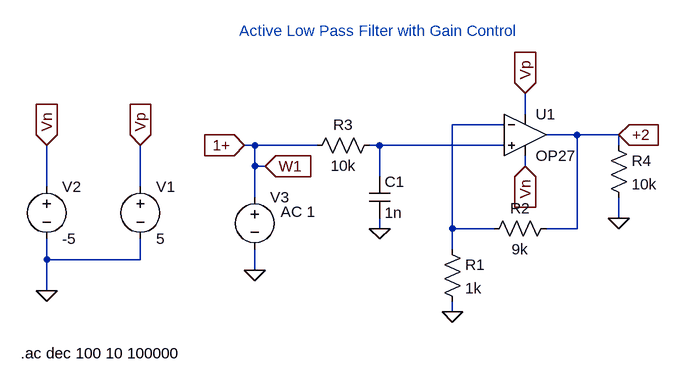
[diagram p0: schematic alpf_gain.asc]
alpf_gain.asc, the LTspice schematic file:
Version 4
SHEET 1 880 680
WIRE 208 -464 208 -496
WIRE 176 -448 96 -448
WIRE 288 -432 240 -432
WIRE 352 -432 288 -432
WIRE -208 -416 -224 -416
WIRE -112 -416 -208 -416
WIRE -16 -416 -32 -416
WIRE 176 -416 -16 -416
WIRE 352 -416 352 -432
WIRE -208 -384 -208 -416
WIRE -192 -384 -208 -384
WIRE 208 -384 208 -400
WIRE -16 -368 -16 -416
WIRE -528 -352 -528 -416
WIRE -384 -352 -384 -416
WIRE -208 -336 -208 -384
WIRE 352 -304 352 -336
WIRE -16 -288 -16 -304
WIRE 96 -288 96 -448
WIRE 160 -288 96 -288
WIRE 288 -288 288 -432
WIRE 288 -288 240 -288
WIRE 96 -256 96 -288
WIRE -528 -240 -528 -272
WIRE -384 -240 -384 -272
WIRE -384 -240 -528 -240
WIRE -208 -224 -208 -256
WIRE -528 -192 -528 -240
WIRE 96 -160 96 -176
FLAG -16 -288 0
FLAG -528 -192 0
FLAG -384 -416 Vp
IOPIN -384 -416 In
FLAG -528 -416 Vn
IOPIN -528 -416 In
FLAG 208 -384 Vn
IOPIN 208 -384 In
FLAG 208 -496 Vp
IOPIN 208 -496 In
FLAG 96 -160 0
FLAG -208 -224 0
FLAG -192 -384 W1
IOPIN -192 -384 In
FLAG -224 -416 1+
IOPIN -224 -416 In
FLAG 352 -304 0
FLAG 352 -432 +2
IOPIN 352 -432 In
SYMBOL Opamps\\OP27 208 -496 R0
SYMATTR InstName U1
SYMBOL res 80 -272 R0
SYMATTR InstName R1
SYMATTR Value 1k
SYMBOL res 256 -304 R90
WINDOW 0 0 56 VBottom 2
WINDOW 3 32 56 VTop 2
SYMATTR InstName R2
SYMATTR Value 9k
SYMBOL res -16 -432 R90
WINDOW 0 0 56 VBottom 2
WINDOW 3 32 56 VTop 2
SYMATTR InstName R3
SYMATTR Value 10k
SYMBOL cap -32 -368 R0
SYMATTR InstName C1
SYMATTR Value 1n
SYMBOL voltage -384 -368 R0
WINDOW 123 0 0 Left 0
WINDOW 39 0 0 Left 0
SYMATTR InstName V1
SYMATTR Value 5
SYMBOL voltage -528 -368 R0
WINDOW 123 0 0 Left 0
WINDOW 39 0 0 Left 0
SYMATTR InstName V2
SYMATTR Value -5
SYMBOL voltage -208 -352 R0
WINDOW 123 40 38 Left 2
WINDOW 39 0 0 Left 0
SYMATTR Value2 AC 1
SYMATTR InstName V3
SYMATTR Value ""
SYMBOL res 336 -432 R0
SYMATTR InstName R4
SYMATTR Value 10k
TEXT -568 -96 Left 2 !.ac dec 100 10 100000
TEXT -232 -592 Left 2 ;Active Low Pass Filter with Gain Control

The netlist it stands for:
* alpf_gain.asc
XU1 N002 N001 Vp Vn +2 OP27  ; pins In+ In- V+ V- OUT
R1 N001 0 1k
R2 +2 N001 9k
R3 N002 1+ 10k
C1 N002 0 1n
V1 Vp 0 5
V2 Vn 0 -5
V3 1+ 0 AC 1
R4 +2 0 10k
.ac dec 100 10 100000
* Active Low Pass Filter with Gain Control
.lib ADI.lib
.backanno
.end